# Altium schematic sheet WiFi_CC3000MOD.SchDoc: WiFi CC3000MOD
size A4
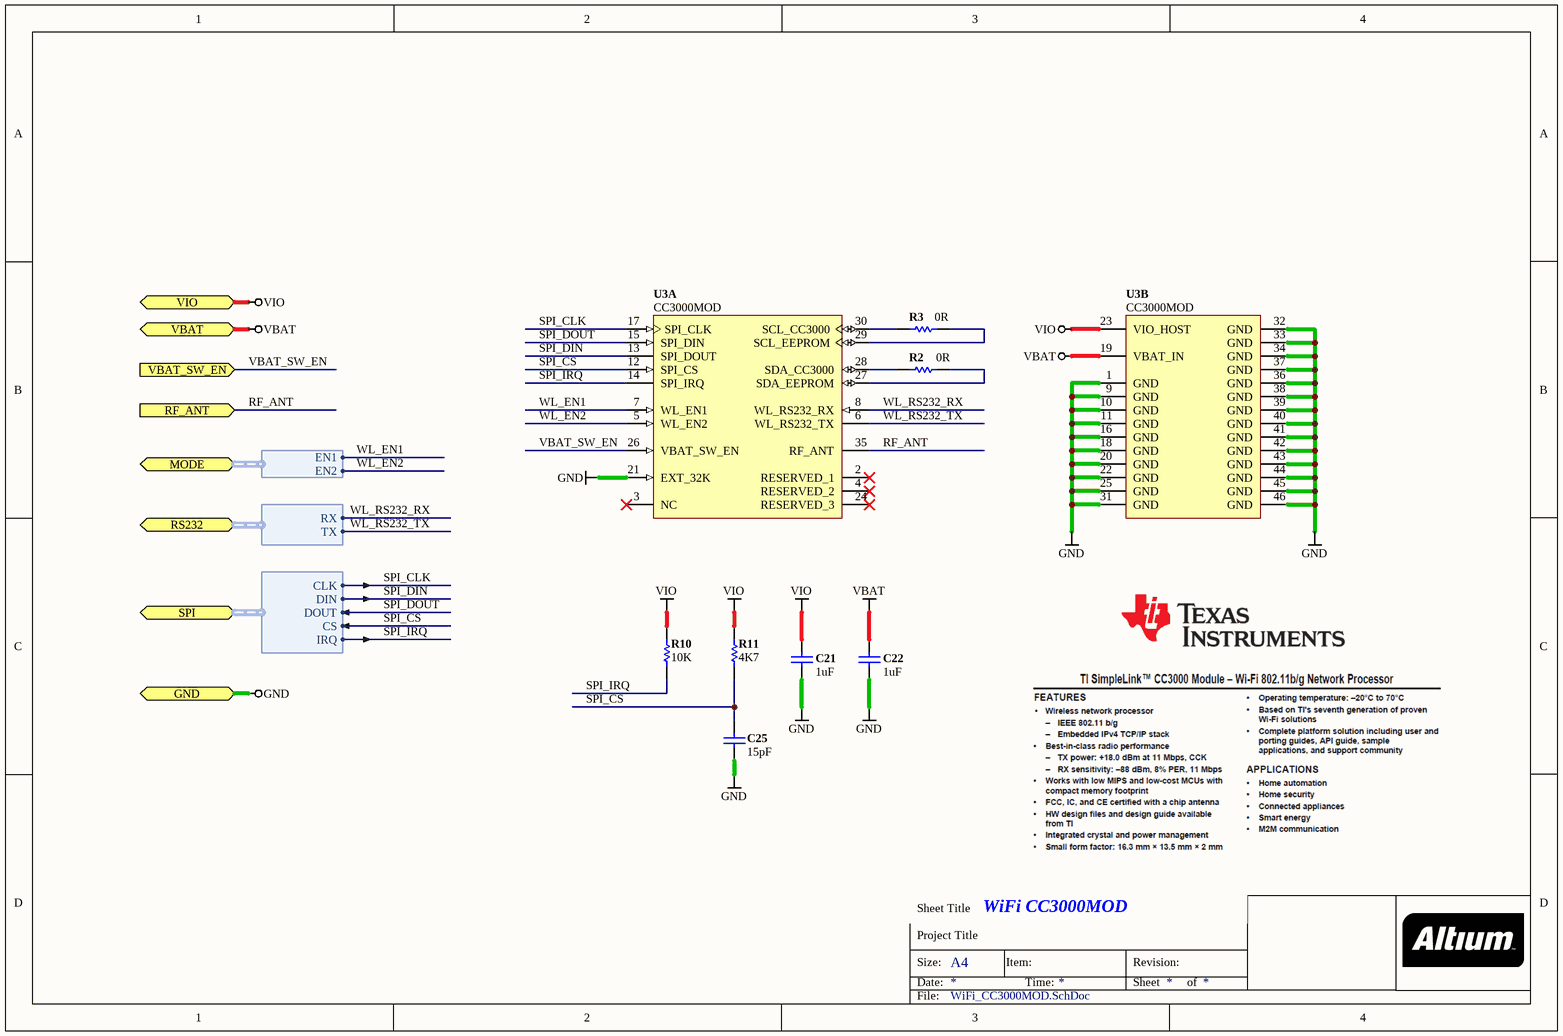
[diagram p0: WiFi_CC3000MOD.SchDoc]

## Parts
C21  value 1uF  [CAPC0603(1608)100_L]  (hidden comment: CAP 1uF 10V 0603(1608))
C22  value 1uF  [CAPC0603(1608)100_L]  (hidden comment: CAP 1uF 10V 0603(1608))
C25  value 15pF  [CAPC0603(1608)100_L]  (hidden comment: CAP 15pF 10V 0603(1608))
R2  0R  [RESC0402(1005)_L]
R3  0R  [RESC0402(1005)_L]
R10  value 10K  [RESC0603(1608)_L]  (hidden comment: 10K 5% 0603(1608))
R11  value 4K7  [RESC0603(1608)_L]  (hidden comment: 4K7 5% 0603(1608))
U3  CC3000MOD  [TI-CC3000MOD-46_V]  (parts A,B of 2)

## Ports
GND, MODE (harness MODE_CC3000), RF_ANT (in), RS232 (harness RS232), SPI (harness SPI_CC3000), VBAT, VBAT_SW_EN (in), VIO

## Harnesses
RS232: RX, TX
SPI_CC3000: CLK, DIN, DOUT, CS, IRQ
MODE_CC3000: EN1, EN2

## Nets
GND: C21.1 C22.1 C25.1 U3.1(GND) U3.9(GND) U3.10(GND) U3.11(GND) U3.16(GND) U3.18(GND) U3.20(GND) U3.21(EXT_32K) U3.22(GND) U3.25(GND) U3.31(GND) U3.32(GND) U3.33(GND) U3.34(GND) U3.36(GND) U3.37(GND) U3.38(GND) U3.39(GND) U3.40(GND) U3.41(GND) U3.42(GND) U3.43(GND) U3.44(GND) U3.45(GND) U3.46(GND) ; port GND
VBAT: C22.2 U3.19(VBAT_IN) ; port VBAT
VIO: C21.2 R10.2 R11.2 U3.23(VIO_HOST) ; port VIO
RF_ANT: U3.35(RF_ANT) ; port RF_ANT
SPI_CLK: U3.17(SPI_CLK) ; port SPI.CLK
SPI_CS: C25.2 R11.1 U3.12(SPI_CS) ; port SPI.CS
SPI_DIN: U3.13(SPI_DOUT) ; port SPI.DIN
SPI_DOUT: U3.15(SPI_DIN) ; port SPI.DOUT
SPI_IRQ: R10.1 U3.14(SPI_IRQ) ; port SPI.IRQ
VBAT_SW_EN: U3.26(VBAT_SW_EN) ; port VBAT_SW_EN
WL_EN1: U3.7(WL_EN1) ; port MODE.EN1
WL_EN2: U3.5(WL_EN2) ; port MODE.EN2
WL_RS232_RX: U3.8(WL_RS232_RX) ; port RS232.RX
WL_RS232_TX: U3.6(WL_RS232_TX) ; port RS232.TX
NetR2_1: R2.1 U3.28(SDA_CC3000)
NetR2_2: R2.2 U3.27(SDA_EEPROM)
NetR3_1: R3.1 U3.30(SCL_CC3000)
NetR3_2: R3.2 U3.29(SCL_EEPROM)

Not connected (* = marked no-connect by the designer): U3 2(RESERVED_1)* 3(NC)* 4(RESERVED_2)* 24(RESERVED_3)*

## Notes on the sheet
- Sheet Title
- Project Title
- Size:
- Date:
- A4
- Item:
- Time:
- Revision:
- Sheet
- of
- File:

## Library data of the parts
C21 C22 = CMP-1035-02733-1: CAP 1uF 10V ±10% 0603 (1608 Metric) Thickness 1mm SMD; Case-EIA: 0603; Case-Metric: 1608; Rated Voltage: 10 V; Max Thickness: 1 mm; Tolerance: ±10%; Technology: SMT
C25 = CMP-1035-00662-1: CAP 15pF 10V ±5% 0603 (1608 Metric) Thickness 1mm SMD; Case-EIA: 0603; Case-Metric: 1608; Rated Voltage: 10 V; Max Thickness: 1 mm; Tolerance: ±5%; Technology: SMT
R2 R3 = CMP-1011-00001-1: Jumper 0402 (1005 Metric); Tolerance: None; Case-Metric: 1005; Case-EIA: 0402; Value: 0.00 Ohm; Power: None; Technology: SMT
R10 = CMP-1012-00098-1: 10K 0.1W 5% 0603 (1608 Metric)  SMD; Case-EIA: 0603; Case-Metric: 1608; Technology: SMT; Tolerance: 5 %; Power: 0.1 W; Price: 0.01
R11 = CMP-1012-00090-1: 4K7 0.1W 5% 0603 (1608 Metric)  SMD; Case-EIA: 0603; Case-Metric: 1608; Technology: SMT; Tolerance: 5 %; Power: 0.1 W
U3 = CMP-0276-00001-1: SimpleLink Wi-Fi Module; Manufacturer: Texas Instruments; Operating Voltage(Min)(V): 2.7; TX Power (Max) (dBm): 18; RX Current (Lowest) (mA): 92; Frequency Range: 2.4 GHz; Operating Voltage(Max)(V): 4.8; Data Rate (Max) (kbps): 7000; DatasheetVersion: SWRS126; PackageDescription: 46-Pin Module, Body 16.3x13.5mm; ComponentLink1URL: http://www.ti.com/; ComponentLink2Description: Datasheet; ComponentLink3Description: Package Specification; PartNumber: CC3000MOD; ComponentLink2URL: http://www.ti.com/lit/ds/symlink/cc3000.pdf; Mounting Technology: Surface Mount; ComponentLink3URL: http://www.ti.com/lit/ds/symlink/cc3000.pdf; ComponentLink1Description: Manufacturer URL; PackageReference: Module-46; Operating Temperature Range (C): -20 to 70